# Altium schematic sheet Sheet2.SchDoc
size A4; SheetNumber: 3; SheetTotal: 3
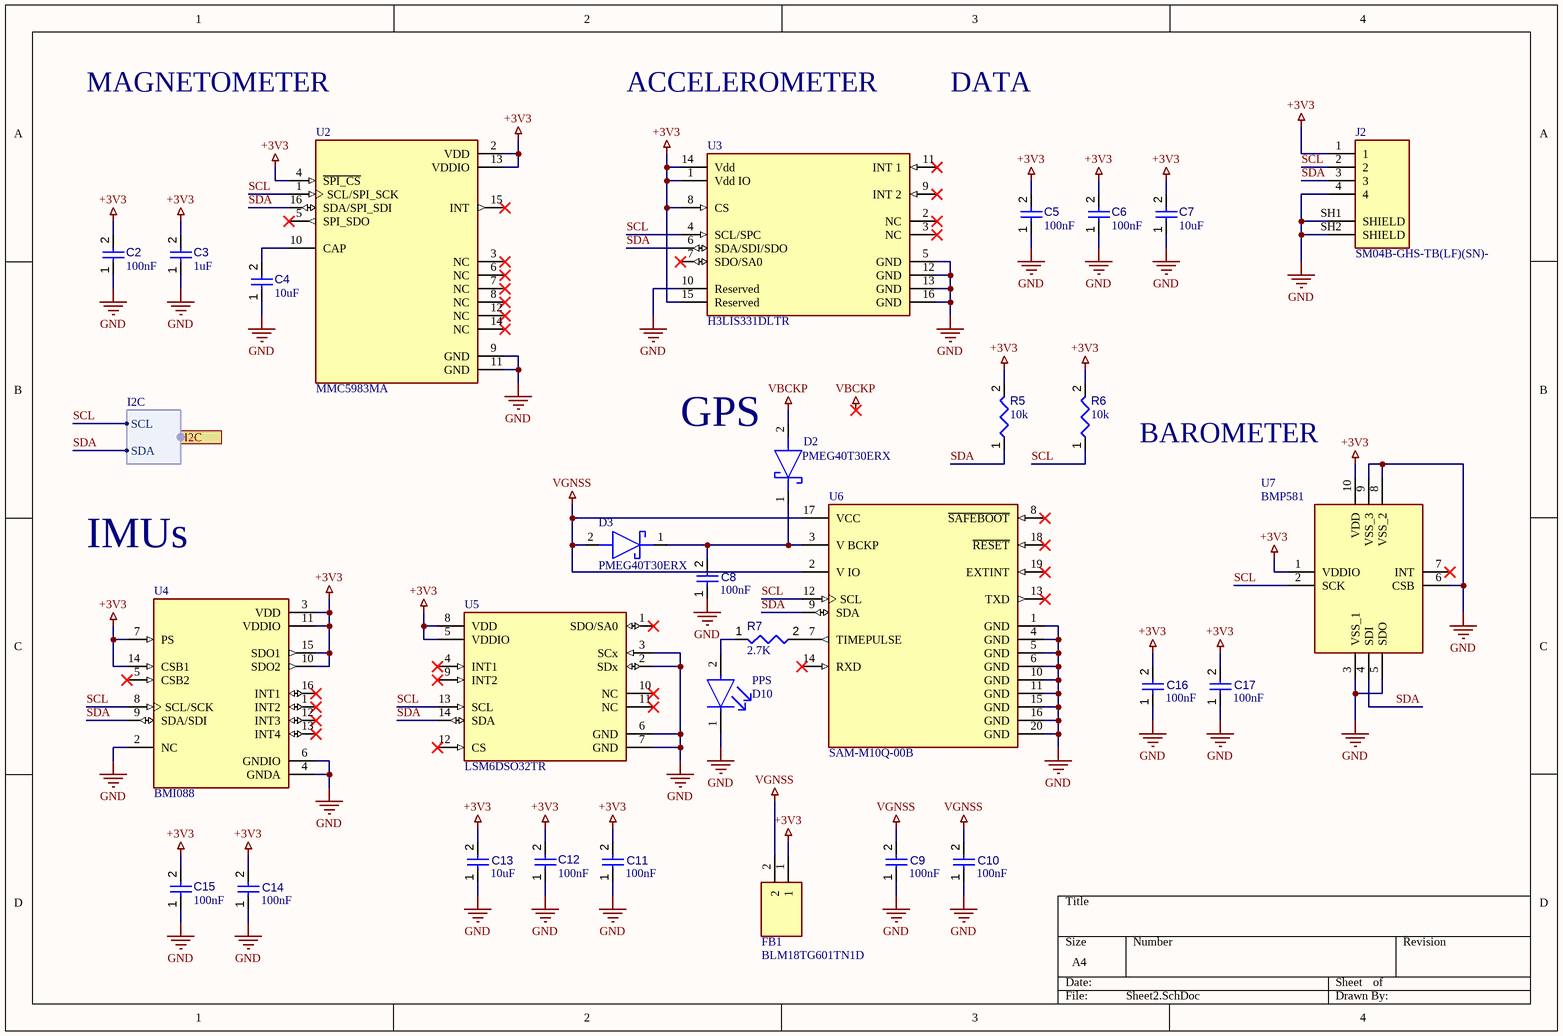
[diagram p0: Sheet2.SchDoc]

## Parts
C2  value 100nF  [CAPC1608X90X40NL10T20]  (hidden comment: Capacitor 100 nF +/-10% 50 V 0603)
C3  value 1uF  [CAPC1608X90X40NL10T20]  (hidden comment: Capacitor 100 nF +/-10% 50 V 0603)
C4  value 10uF  [CAPC1608X90X40NL10T20]  (hidden comment: Capacitor 100 nF +/-10% 50 V 0603)
C5  value 100nF  [CAPC1608X90X40NL10T20]  (hidden comment: Capacitor 100 nF +/-10% 50 V 0603)
C6  value 100nF  [CAPC1608X90X40NL10T20]  (hidden comment: Capacitor 100 nF +/-10% 50 V 0603)
C7  value 10uF  [CAPC1608X90X40NL10T20]  (hidden comment: Capacitor 100 nF +/-10% 50 V 0603)
C8  value 100nF  [CAPC1608X90X40NL10T20]  (hidden comment: Capacitor 100 nF +/-10% 50 V 0603)
C9  value 100nF  [CAPC1608X90X40NL10T20]  (hidden comment: Capacitor 100 nF +/-10% 50 V 0603)
C10  value 100nF  [CAPC1608X90X40NL10T20]  (hidden comment: Capacitor 100 nF +/-10% 50 V 0603)
C11  value 100nF  [CAPC1608X90X40NL10T20]  (hidden comment: Capacitor 100 nF +/-10% 50 V 0603)
C12  value 100nF  [CAPC1608X90X40NL10T20]  (hidden comment: Capacitor 100 nF +/-10% 50 V 0603)
C13  value 10uF  [CAPC1608X90X40NL10T20]  (hidden comment: Capacitor 100 nF +/-10% 50 V 0603)
C14  value 100nF  [CAPC1608X90X40NL10T20]  (hidden comment: Capacitor 100 nF +/-10% 50 V 0603)
C15  value 100nF  [CAPC1608X90X40NL10T20]  (hidden comment: Capacitor 100 nF +/-10% 50 V 0603)
C16  value 100nF  [CAPC1608X90X40NL10T20]  (hidden comment: Capacitor 100 nF +/-10% 50 V 0603)
C17  value 100nF  [CAPC1608X90X40NL10T20]  (hidden comment: Capacitor 100 nF +/-10% 50 V 0603)
D2  PMEG40T30ERX  [SODFL3517X110N]
D3  PMEG40T30ERX  [SODFL3517X110N]
FB1  BLM18TG601TN1D  [BLM18EG101TH1D]
J2  SM04B-GHS-TB(LF)(SN)-  [JST_SM04B-GHS-TB(LF)(SN)-]
PPS  D10  [FP-LTST-C191TBKT-MFG]
R5  value 10k  [RESC1608X55X25ML10T15]  (hidden comment: Resistor 10k +/-1% 0603 100 mW)
R6  value 10k  [RESC1608X55X25ML10T15]  (hidden comment: Resistor 10k +/-1% 0603 100 mW)
R7  value 2.7K  [RESC1608X55X25ML10T15]  (hidden comment: Resistor 10k +/-1% 0603 100 mW)
U2  MMC5983MA  [PQFN50P300X300X100-16N]
U3  H3LIS331DLTR  [FP-TFLGA16-7983231-MFG]
U4  BMI088  [PQFN50P450X300X100-16N]
U5  LSM6DSO32TR  [FP-LGA-14L-DM00249496-MFG]
U6  SAM-M10Q-00B  [FP-SAM-M10Q-00B-MFG]
U7  BMP581  [BMP581]

## Ports
I2C (harness I2C, see Main_Board[2B], Sheet1[3D])

## Harnesses
I2C: SCL, SDA

## Nets
+3V3: C2.2 C3.2 C5.2 C6.2 C7.2 C11.2 C12.2 C13.2 C14.2 C15.2 C16.2 C17.2 FB1.1 J2.1 R5.2 R6.2 U2.2(VDD) U2.4(~{SPI_CS}) U2.13(VDDIO) U3.1(Vdd_IO) U3.8(CS) U3.14(Vdd) U3.15(Reserved) U4.3(VDD) U4.7(PS) U4.10(SDO2) U4.11(VDDIO) U4.14(CSB1) U4.15(SDO1) U5.5(VDDIO) U5.8(VDD) U7.1(VDDIO) U7.10(VDD)
GND: C2.1 C3.1 C4.1 C5.1 C6.1 C7.1 C8.1 C9.1 C10.1 C11.1 C12.1 C13.1 C14.1 C15.1 C16.1 C17.1 J2.4 J2.SH1(SHIELD) J2.SH2(SHIELD) PPS.1(C) U2.9(GND) U2.11(GND) U3.5(GND) U3.10(Reserved) U3.12(GND) U3.13(GND) U3.16(GND) U4.2(NC) U4.4(GNDA) U4.6(GNDIO) U5.2(SDx) U5.3(SCx) U5.6(GND) U5.7(GND) U6.1(GND) U6.4(GND) U6.5(GND) U6.6(GND) U6.10(GND) U6.11(GND) U6.15(GND) U6.16(GND) U6.20(GND) U7.3(VSS_1) U7.5(SDO) U7.6(CSB) U7.8(VSS_2) U7.9(VSS_3)
VBCKP: D2.2(A)
VGNSS: C9.2 C10.2 D3.2(A) FB1.2 U6.2(V_IO) U6.17(VCC)
SCL: J2.2 R6.1 U2.1(SCL/SPI_SCK) U3.4(SCL/SPC) U4.8(SCL/SCK) U5.13(SCL) U6.12(SCL) U7.2(SCK) ; port I2C.SCL
SDA: J2.3 R5.1 U2.16(SDA/SPI_SDI) U3.6(SDA/SDI/SDO) U4.9(SDA/SDI) U5.14(SDA) U6.9(SDA) U7.4(SDI) ; port I2C.SDA
NetC4_2: C4.2 U2.10(CAP)
NetC8_2: C8.2 D2.1(K) D3.1(K) U6.3(V_BCKP)
NetPPS_2: PPS.2(A) R7.1
NetR7_2: R7.2 U6.7(TIMEPULSE)

Not connected (* = marked no-connect by the designer): U2 3(NC)* 5(SPI_SDO)* 6(NC)* 7(NC)* 8(NC)* 12(NC)* 14(NC)* 15(INT)*; U3 2(NC)* 3(NC)* 7(SDO/SA0)* 9(INT_2)* 11(INT_1)*; U4 1(INT2)* 5(CSB2)* 12(INT3)* 13(INT4)* 16(INT1)*; U5 1(SDO/SA0)* 4(INT1)* 9(INT2)* 10(NC)* 11(NC)* 12(CS)*; U6 8(~{SAFEBOOT})* 13(TXD)* 14(RXD)* 18(~{RESET})* 19(EXTINT)*; U7 7(INT)*

## Notes on the sheet
- MAGNETOMETER
- ACCELEROMETER
- DATA
- (near D2) GPS
- BAROMETER
- IMUs
- Labels drawn without touching a wire or pin: VBCKP

## Library data of the parts
C2-C17 = CMP-001-00017-6: Chip Capacitor, 100 nF, +/- 10%, 50 V, 0603 (1608 Metric); Voltage Rating: 50V; Capacitor Type: Ceramic; Tolerance: 10%; Mounting Technology: SM; Max Operating Temperature: 125°C; RoHS Compliant: True; Pins: 2; Case/Package: 0603; Min Operating Temperature: -55°C
D2 D3 = PMEG60T30ELRX: Schottky Diode; Manufacturer_Name: Nexperia; Datasheet Link: https://assets.nexperia.com/documents/data-sheet/PMEG60T30ELR.pdf; Height: 1.1mm; Manufacturer_Part_Number: PMEG60T30ELRX; Mouser Part Number: 771-PMEG60T30ELRX; Mouser Price/Stock: https://www.mouser.co.uk/ProductDetail/Nexperia/PMEG60T30ELRX?qs=MLItCLRbWswWnbT%2FWpJcxg%3D%3D; Arrow Part Number: PMEG60T30ELRX; Arrow Price/Stock: https://www.arrow.com/en/products/pmeg60t30elrx/nexperia?region=nac
FB1 = BLM18TG601TN1D: Ferrite Bead; Manufacturer_Name: Murata Electronics; Datasheet Link: http://www.murata.com/~/media/webrenewal/support/library/catalog/products/emc/emifil/c31e.ashx?la=en-gb; Height: 0.75mm; Manufacturer_Part_Number: BLM18TG601TN1D; Mouser Part Number: 81-BLM18TG601TN1D; Mouser Price/Stock: https://www.mouser.co.uk/ProductDetail/Murata-Electronics/BLM18TG601TN1D/?qs=%2F%252BYoplLUB5j4EvNKGf%252BxGQ%3D%3D; Arrow Part Number: BLM18TG601TN1D; Arrow Price/Stock: https://www.arrow.com/en/products/blm18tg601tn1d/murata-manufacturing?region=nac
J2 = CMP-002-00087-1: Connector Header Surface Mount, Right Angle 4 position 0.049 _1.25mm_; MP: SM04B-GHS-TB_LF__SN_-; MF: JST Sales; Case/Package: None; Value: *; Pins: 6; Design Item ID: SM04B-GHS-TB(LF)(SN)-; SnapEDA_Link: https://www.snapeda.com/parts/SM04B-GHS-TB%28LF%29%28SN%29-/JST%20Sales%20America%20Inc./view-part/2759740/?ref=snap; Source: SnapEDAsch.SchLib; Price: None; Availability: Unavailable; Component Type: Standard
PPS = CMP-22017-000008-1: LED BLUE CLEAR CHIP SMD; Lens Color: Colorless; Dominant Wavelength: 475nm; Forward Current: 20mA; Wavelength: 468nm; Viewing Angle: 130°; Power Dissipation: 76mW; Luminous Intensity: 180mcd; Reverse Voltage: 5V; Number of Elements: 1; Lens Style: Diffused; Forward Voltage: 3.8V; Max Power Dissipation: 75mW; Case Code (Metric): 1608; Packaging: Tape and Reel; Case/Package: 0603; Depth: 1.6mm; Mount: Surface Mount; Lead Free: Lead Free; Min Operating Temperature: -20°C; Lens Transparency: Clear; Illumination Color: Blue; Height: 0.55mm; Test Current: 20mA; Case Code (Imperial): 0603; Max Operating Temperature: 80°C; Number of Pins: 2; Length: 0.8mm; Radiation Hardening: No; Package Quantity: 1; Number of LEDs: 1; Width: 0.8mm; Color: Blue
R5-R7 = CMP-009-00017-5: Chip Resistor, 10 KOhm, +/- 1%, 01 W, -55 to 155 degC, 0603 (1608 Metric); Voltage Rating: 50V; Power: 100mW; RoHS Compliant: True; Min Operating Temperature: -55°C; Pins: 2; Case/Package: 0603; Mounting Technology: SM; Max Operating Temperature: 155°C; Tolerance: 1%
U2 = MMC5983MA: MMC5983 series Magnetic, Magnetometer Sensor Evaluation Board; MF: {'manufacturer': u'Memsic Inc.'}; Availability: Unavailable; Package: None; MP: MMC5983MA; Value: *; Price: None
U3 = CMP-12175-000002-1: ACCEL 100-400G I2C/SPI 16TFLGA; Manufacturer: STMicroelectronics; Min Supply Voltage: 2.16V; Accel Axis: X+Y and Z; Sensor Output: I2C,SPI; Accel Resolution: 16bits; Operating Supply Current: 10-300uA; Accel Range: 100/200/400g; Max Supply Voltage: 3.6V; Temperature: -40°C to +85°C; Octopart: https://octopart.com/h3lis331dltr-stmicroelectronics-29186499; Automotive: No; Digikey Description: ACCEL 100-400G I2C/SPI 16TFLGA; Device Class L3: Accelerometers; ComponentLink2URL: https://www.st.com/resource/en/datasheet/h3lis331dl.pdf; Device Class L2: Motion Sensors; Package: TFLGA16-7983231; Mouser Description: Accelerometer Triple +/-100g/+/-200g/+/-400g 2.5V 16-Pin TFLGA T/R; ComponentLink2Description: Datasheet; Device Class L1: Sensors; Lead Free: Yes; RoHS: TRUE; Footprint Url: https://www.st.com/content/ccc/resource/technical/document/technical_note/73/17/9c/16/dd/96/4a/01/CD00134799.pdf/files/CD00134799.pdf/jcr:content/translations/en.CD00134799.pdf; Height: 1mm; Category: IC; Manufacturer Part Number: H3LIS331DLTR; Temperature Range Low: -40°C; Temperature Range High: +85°C
U4 = BMI088: High-performance 6-axis inertial sensor (accelerometer + gyroscope) <a href="https://pricing.snapeda.com/parts/BMI088/Bosch%20Sensortec/view-part?ref=eda">Check prices</a>; MF: {'manufacturer': u'Bosch Sensortec'}; Availability: Unavailable; Value: *; Package: None; Price: None; MP: BMI088
U5 = CMP-12177-000015-1: INEMO INERTIAL MODULE: 3D ACCELE
U6 = CMP-207130-000027-1: M10 GNSS LGA PATCH ANTENNA MOD
U7 = BMP581: Undefined or Miscellaneous; Manufacturer_Name: BOSCH; Datasheet Link: https://www.bosch-sensortec.com/media/boschsensortec/downloads/datasheets/bst-bmp581-ds004.pdf; Height: 0.8mm; Manufacturer_Part_Number: BMP581; Mouser Part Number: 262-BMP581; Mouser Price/Stock: https://www.mouser.co.uk/ProductDetail/Bosch-Sensortec/BMP581?qs=Li%252BoUPsLEntPL9tlFmcgXg%3D%3D; Arrow Part Number: BMP581; Arrow Price/Stock: https://www.arrow.com/en/products/bmp581/bosch?region=nac